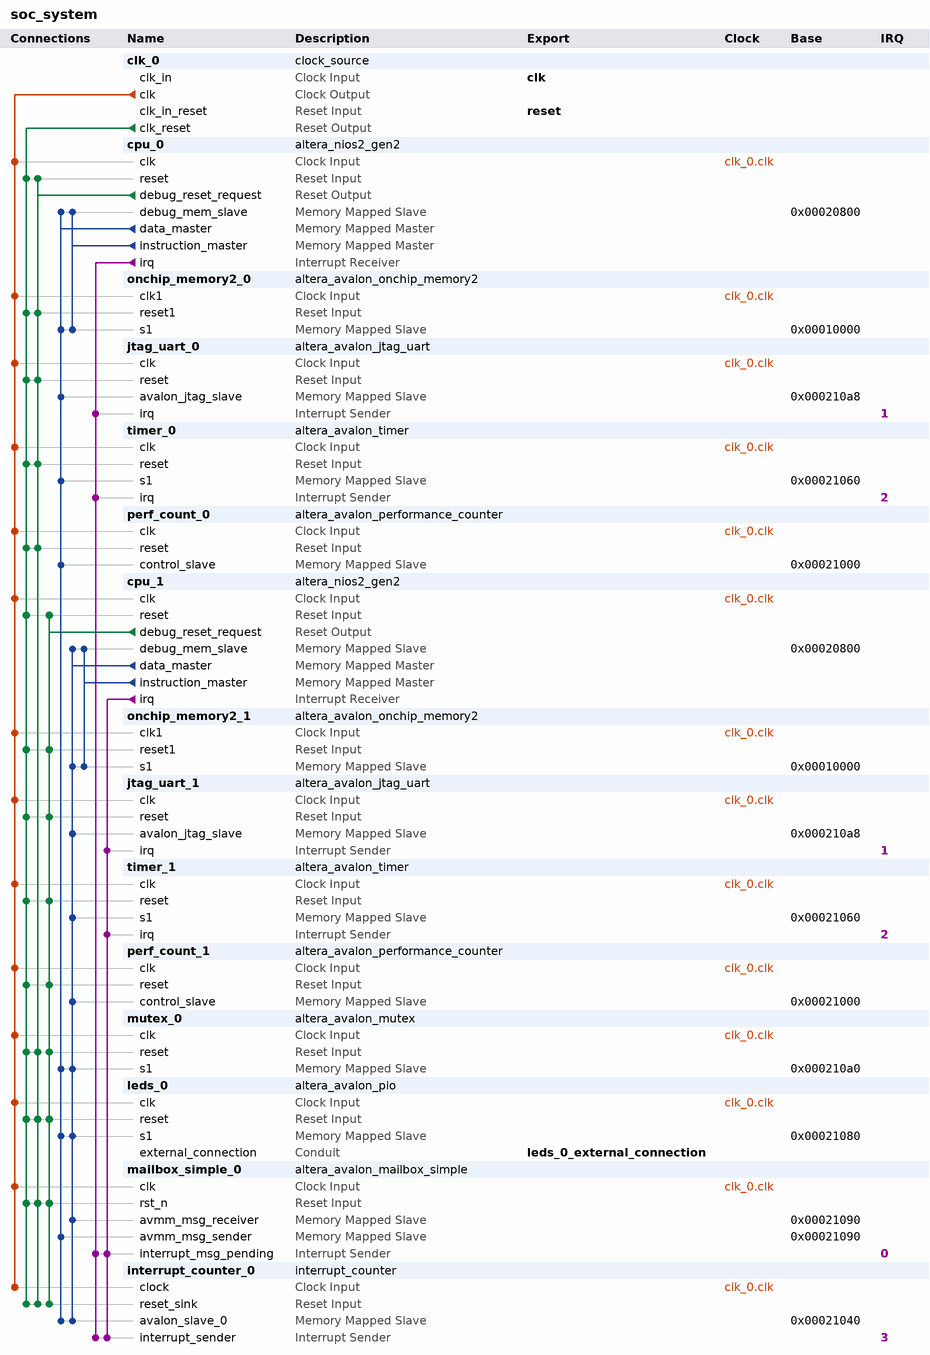
[diagram p0: system contents]
# Platform Designer (Qsys) system soc_system, Cyclone V 5CSEMA5F31C6
# Parameters at their usual value, and those the tool derives, are not listed.
package require -exact qsys 18.1
create_system soc_system
set_project_property DEVICE_FAMILY {Cyclone V}
set_project_property DEVICE 5CSEMA5F31C6

add_instance clk_0 clock_source 18.1
set_instance_parameter_value clk_0 clockFrequency 50000000

add_instance cpu_0 altera_nios2_gen2 18.1
set_instance_parameter_value cpu_0 dcache_size 2048
set_instance_parameter_value cpu_0 exceptionSlave onchip_memory2_0.s1
set_instance_parameter_value cpu_0 icache_size 4096
set_instance_parameter_value cpu_0 impl Fast
set_instance_parameter_value cpu_0 resetSlave onchip_memory2_0.s1

add_instance onchip_memory2_0 altera_avalon_onchip_memory2 18.1
set_instance_parameter_value onchip_memory2_0 dataWidth 32
set_instance_parameter_value onchip_memory2_0 dualPort false
set_instance_parameter_value onchip_memory2_0 initMemContent true
set_instance_parameter_value onchip_memory2_0 initializationFileName onchip_mem.hex
set_instance_parameter_value onchip_memory2_0 memorySize 65536

add_instance jtag_uart_0 altera_avalon_jtag_uart 18.1
set_instance_parameter_value jtag_uart_0 simInteractiveOptions NO_INTERACTIVE_WINDOWS

add_instance timer_0 altera_avalon_timer 18.1
set_instance_parameter_value timer_0 period 1
set_instance_parameter_value timer_0 periodUnits SEC

add_instance perf_count_0 altera_avalon_performance_counter 18.1
set_instance_parameter_value perf_count_0 numberOfSections 3

add_instance cpu_1 altera_nios2_gen2 18.1
set_instance_parameter_value cpu_1 cpuID 1
set_instance_parameter_value cpu_1 dcache_size 2048
set_instance_parameter_value cpu_1 exceptionSlave onchip_memory2_1.s1
set_instance_parameter_value cpu_1 icache_size 4096
set_instance_parameter_value cpu_1 impl Fast
set_instance_parameter_value cpu_1 resetSlave onchip_memory2_1.s1

add_instance onchip_memory2_1 altera_avalon_onchip_memory2 18.1
set_instance_parameter_value onchip_memory2_1 dataWidth 32
set_instance_parameter_value onchip_memory2_1 dualPort false
set_instance_parameter_value onchip_memory2_1 initMemContent true
set_instance_parameter_value onchip_memory2_1 initializationFileName onchip_mem.hex
set_instance_parameter_value onchip_memory2_1 memorySize 65536

add_instance jtag_uart_1 altera_avalon_jtag_uart 18.1
set_instance_parameter_value jtag_uart_1 simInteractiveOptions NO_INTERACTIVE_WINDOWS

add_instance timer_1 altera_avalon_timer 18.1
set_instance_parameter_value timer_1 period 1
set_instance_parameter_value timer_1 periodUnits SEC

add_instance perf_count_1 altera_avalon_performance_counter 18.1
set_instance_parameter_value perf_count_1 numberOfSections 3

add_instance mutex_0 altera_avalon_mutex 18.1

add_instance leds_0 altera_avalon_pio 18.1
set_instance_parameter_value leds_0 direction Output
set_instance_parameter_value leds_0 width 8

add_instance mailbox_simple_0 altera_avalon_mailbox_simple 18.1
set_instance_parameter_value mailbox_simple_0 AWIDTH 2
set_instance_parameter_value mailbox_simple_0 DWIDTH 32
set_instance_parameter_value mailbox_simple_0 MSG_ARRIVAL_NOTIFY 1
set_instance_parameter_value mailbox_simple_0 MSG_SPACE_NOTIFY 0

add_instance interrupt_counter_0 interrupt_counter 1.0

# connections
add_connection clk_0.clk cpu_0.clk clock
add_connection clk_0.clk cpu_1.clk clock
add_connection clk_0.clk interrupt_counter_0.clock clock
add_connection clk_0.clk jtag_uart_0.clk clock
add_connection clk_0.clk jtag_uart_1.clk clock
add_connection clk_0.clk leds_0.clk clock
add_connection clk_0.clk mailbox_simple_0.clk clock
add_connection clk_0.clk mutex_0.clk clock
add_connection clk_0.clk onchip_memory2_0.clk1 clock
add_connection clk_0.clk onchip_memory2_1.clk1 clock
add_connection clk_0.clk perf_count_0.clk clock
add_connection clk_0.clk perf_count_1.clk clock
add_connection clk_0.clk timer_0.clk clock
add_connection clk_0.clk timer_1.clk clock
add_connection clk_0.clk_reset cpu_0.reset reset
add_connection clk_0.clk_reset cpu_1.reset reset
add_connection clk_0.clk_reset interrupt_counter_0.reset_sink reset
add_connection clk_0.clk_reset jtag_uart_0.reset reset
add_connection clk_0.clk_reset jtag_uart_1.reset reset
add_connection clk_0.clk_reset leds_0.reset reset
add_connection clk_0.clk_reset mailbox_simple_0.rst_n reset
add_connection clk_0.clk_reset mutex_0.reset reset
add_connection clk_0.clk_reset onchip_memory2_0.reset1 reset
add_connection clk_0.clk_reset onchip_memory2_1.reset1 reset
add_connection clk_0.clk_reset perf_count_0.reset reset
add_connection clk_0.clk_reset perf_count_1.reset reset
add_connection clk_0.clk_reset timer_0.reset reset
add_connection clk_0.clk_reset timer_1.reset reset
add_connection cpu_0.debug_reset_request cpu_0.reset reset
add_connection cpu_0.debug_reset_request interrupt_counter_0.reset_sink reset
add_connection cpu_0.debug_reset_request jtag_uart_0.reset reset
add_connection cpu_0.debug_reset_request leds_0.reset reset
add_connection cpu_0.debug_reset_request mailbox_simple_0.rst_n reset
add_connection cpu_0.debug_reset_request mutex_0.reset reset
add_connection cpu_0.debug_reset_request onchip_memory2_0.reset1 reset
add_connection cpu_0.debug_reset_request perf_count_0.reset reset
add_connection cpu_0.debug_reset_request timer_0.reset reset
add_connection cpu_1.debug_reset_request cpu_1.reset reset
add_connection cpu_1.debug_reset_request interrupt_counter_0.reset_sink reset
add_connection cpu_1.debug_reset_request jtag_uart_1.reset reset
add_connection cpu_1.debug_reset_request leds_0.reset reset
add_connection cpu_1.debug_reset_request mailbox_simple_0.rst_n reset
add_connection cpu_1.debug_reset_request mutex_0.reset reset
add_connection cpu_1.debug_reset_request onchip_memory2_1.reset1 reset
add_connection cpu_1.debug_reset_request perf_count_1.reset reset
add_connection cpu_1.debug_reset_request timer_1.reset reset
add_connection cpu_0.data_master cpu_0.debug_mem_slave avalon
set_connection_parameter_value cpu_0.data_master/cpu_0.debug_mem_slave baseAddress 0x00020800
add_connection cpu_0.data_master interrupt_counter_0.avalon_slave_0 avalon
set_connection_parameter_value cpu_0.data_master/interrupt_counter_0.avalon_slave_0 baseAddress 0x00021040
add_connection cpu_0.data_master jtag_uart_0.avalon_jtag_slave avalon
set_connection_parameter_value cpu_0.data_master/jtag_uart_0.avalon_jtag_slave baseAddress 0x000210a8
add_connection cpu_0.data_master leds_0.s1 avalon
set_connection_parameter_value cpu_0.data_master/leds_0.s1 baseAddress 0x00021080
add_connection cpu_0.data_master mailbox_simple_0.avmm_msg_sender avalon
set_connection_parameter_value cpu_0.data_master/mailbox_simple_0.avmm_msg_sender baseAddress 0x00021090
add_connection cpu_0.data_master mutex_0.s1 avalon
set_connection_parameter_value cpu_0.data_master/mutex_0.s1 baseAddress 0x000210a0
add_connection cpu_0.data_master onchip_memory2_0.s1 avalon
set_connection_parameter_value cpu_0.data_master/onchip_memory2_0.s1 baseAddress 0x00010000
add_connection cpu_0.data_master perf_count_0.control_slave avalon
set_connection_parameter_value cpu_0.data_master/perf_count_0.control_slave baseAddress 0x00021000
add_connection cpu_0.data_master timer_0.s1 avalon
set_connection_parameter_value cpu_0.data_master/timer_0.s1 baseAddress 0x00021060
add_connection cpu_0.instruction_master cpu_0.debug_mem_slave avalon
set_connection_parameter_value cpu_0.instruction_master/cpu_0.debug_mem_slave baseAddress 0x00020800
add_connection cpu_0.instruction_master onchip_memory2_0.s1 avalon
set_connection_parameter_value cpu_0.instruction_master/onchip_memory2_0.s1 baseAddress 0x00010000
add_connection cpu_1.data_master cpu_1.debug_mem_slave avalon
set_connection_parameter_value cpu_1.data_master/cpu_1.debug_mem_slave baseAddress 0x00020800
add_connection cpu_1.data_master interrupt_counter_0.avalon_slave_0 avalon
set_connection_parameter_value cpu_1.data_master/interrupt_counter_0.avalon_slave_0 baseAddress 0x00021040
add_connection cpu_1.data_master jtag_uart_1.avalon_jtag_slave avalon
set_connection_parameter_value cpu_1.data_master/jtag_uart_1.avalon_jtag_slave baseAddress 0x000210a8
add_connection cpu_1.data_master leds_0.s1 avalon
set_connection_parameter_value cpu_1.data_master/leds_0.s1 baseAddress 0x00021080
add_connection cpu_1.data_master mailbox_simple_0.avmm_msg_receiver avalon
set_connection_parameter_value cpu_1.data_master/mailbox_simple_0.avmm_msg_receiver baseAddress 0x00021090
add_connection cpu_1.data_master mutex_0.s1 avalon
set_connection_parameter_value cpu_1.data_master/mutex_0.s1 baseAddress 0x000210a0
add_connection cpu_1.data_master onchip_memory2_1.s1 avalon
set_connection_parameter_value cpu_1.data_master/onchip_memory2_1.s1 baseAddress 0x00010000
add_connection cpu_1.data_master perf_count_1.control_slave avalon
set_connection_parameter_value cpu_1.data_master/perf_count_1.control_slave baseAddress 0x00021000
add_connection cpu_1.data_master timer_1.s1 avalon
set_connection_parameter_value cpu_1.data_master/timer_1.s1 baseAddress 0x00021060
add_connection cpu_1.instruction_master cpu_1.debug_mem_slave avalon
set_connection_parameter_value cpu_1.instruction_master/cpu_1.debug_mem_slave baseAddress 0x00020800
add_connection cpu_1.instruction_master onchip_memory2_1.s1 avalon
set_connection_parameter_value cpu_1.instruction_master/onchip_memory2_1.s1 baseAddress 0x00010000
add_connection cpu_0.irq interrupt_counter_0.interrupt_sender interrupt
set_connection_parameter_value cpu_0.irq/interrupt_counter_0.interrupt_sender irqNumber 3
add_connection cpu_0.irq jtag_uart_0.irq interrupt
set_connection_parameter_value cpu_0.irq/jtag_uart_0.irq irqNumber 1
add_connection cpu_0.irq mailbox_simple_0.interrupt_msg_pending interrupt
set_connection_parameter_value cpu_0.irq/mailbox_simple_0.interrupt_msg_pending irqNumber 0
add_connection cpu_0.irq timer_0.irq interrupt
set_connection_parameter_value cpu_0.irq/timer_0.irq irqNumber 2
add_connection cpu_1.irq interrupt_counter_0.interrupt_sender interrupt
set_connection_parameter_value cpu_1.irq/interrupt_counter_0.interrupt_sender irqNumber 3
add_connection cpu_1.irq jtag_uart_1.irq interrupt
set_connection_parameter_value cpu_1.irq/jtag_uart_1.irq irqNumber 1
add_connection cpu_1.irq mailbox_simple_0.interrupt_msg_pending interrupt
set_connection_parameter_value cpu_1.irq/mailbox_simple_0.interrupt_msg_pending irqNumber 0
add_connection cpu_1.irq timer_1.irq interrupt
set_connection_parameter_value cpu_1.irq/timer_1.irq irqNumber 2

# exported interfaces
add_interface clk clock sink
set_interface_property clk EXPORT_OF clk_0.clk_in
add_interface leds_0_external_connection conduit end
set_interface_property leds_0_external_connection EXPORT_OF leds_0.external_connection
add_interface reset reset sink
set_interface_property reset EXPORT_OF clk_0.clk_in_reset

set_interconnect_requirement {$system} qsys_mm.clockCrossingAdapter HANDSHAKE
set_interconnect_requirement {$system} qsys_mm.enableEccProtection FALSE
set_interconnect_requirement {$system} qsys_mm.insertDefaultSlave FALSE
set_interconnect_requirement {$system} qsys_mm.maxAdditionalLatency 1

save_system soc_system.qsys
